# EAGLE design projekt (EAGLE 7.5.0)
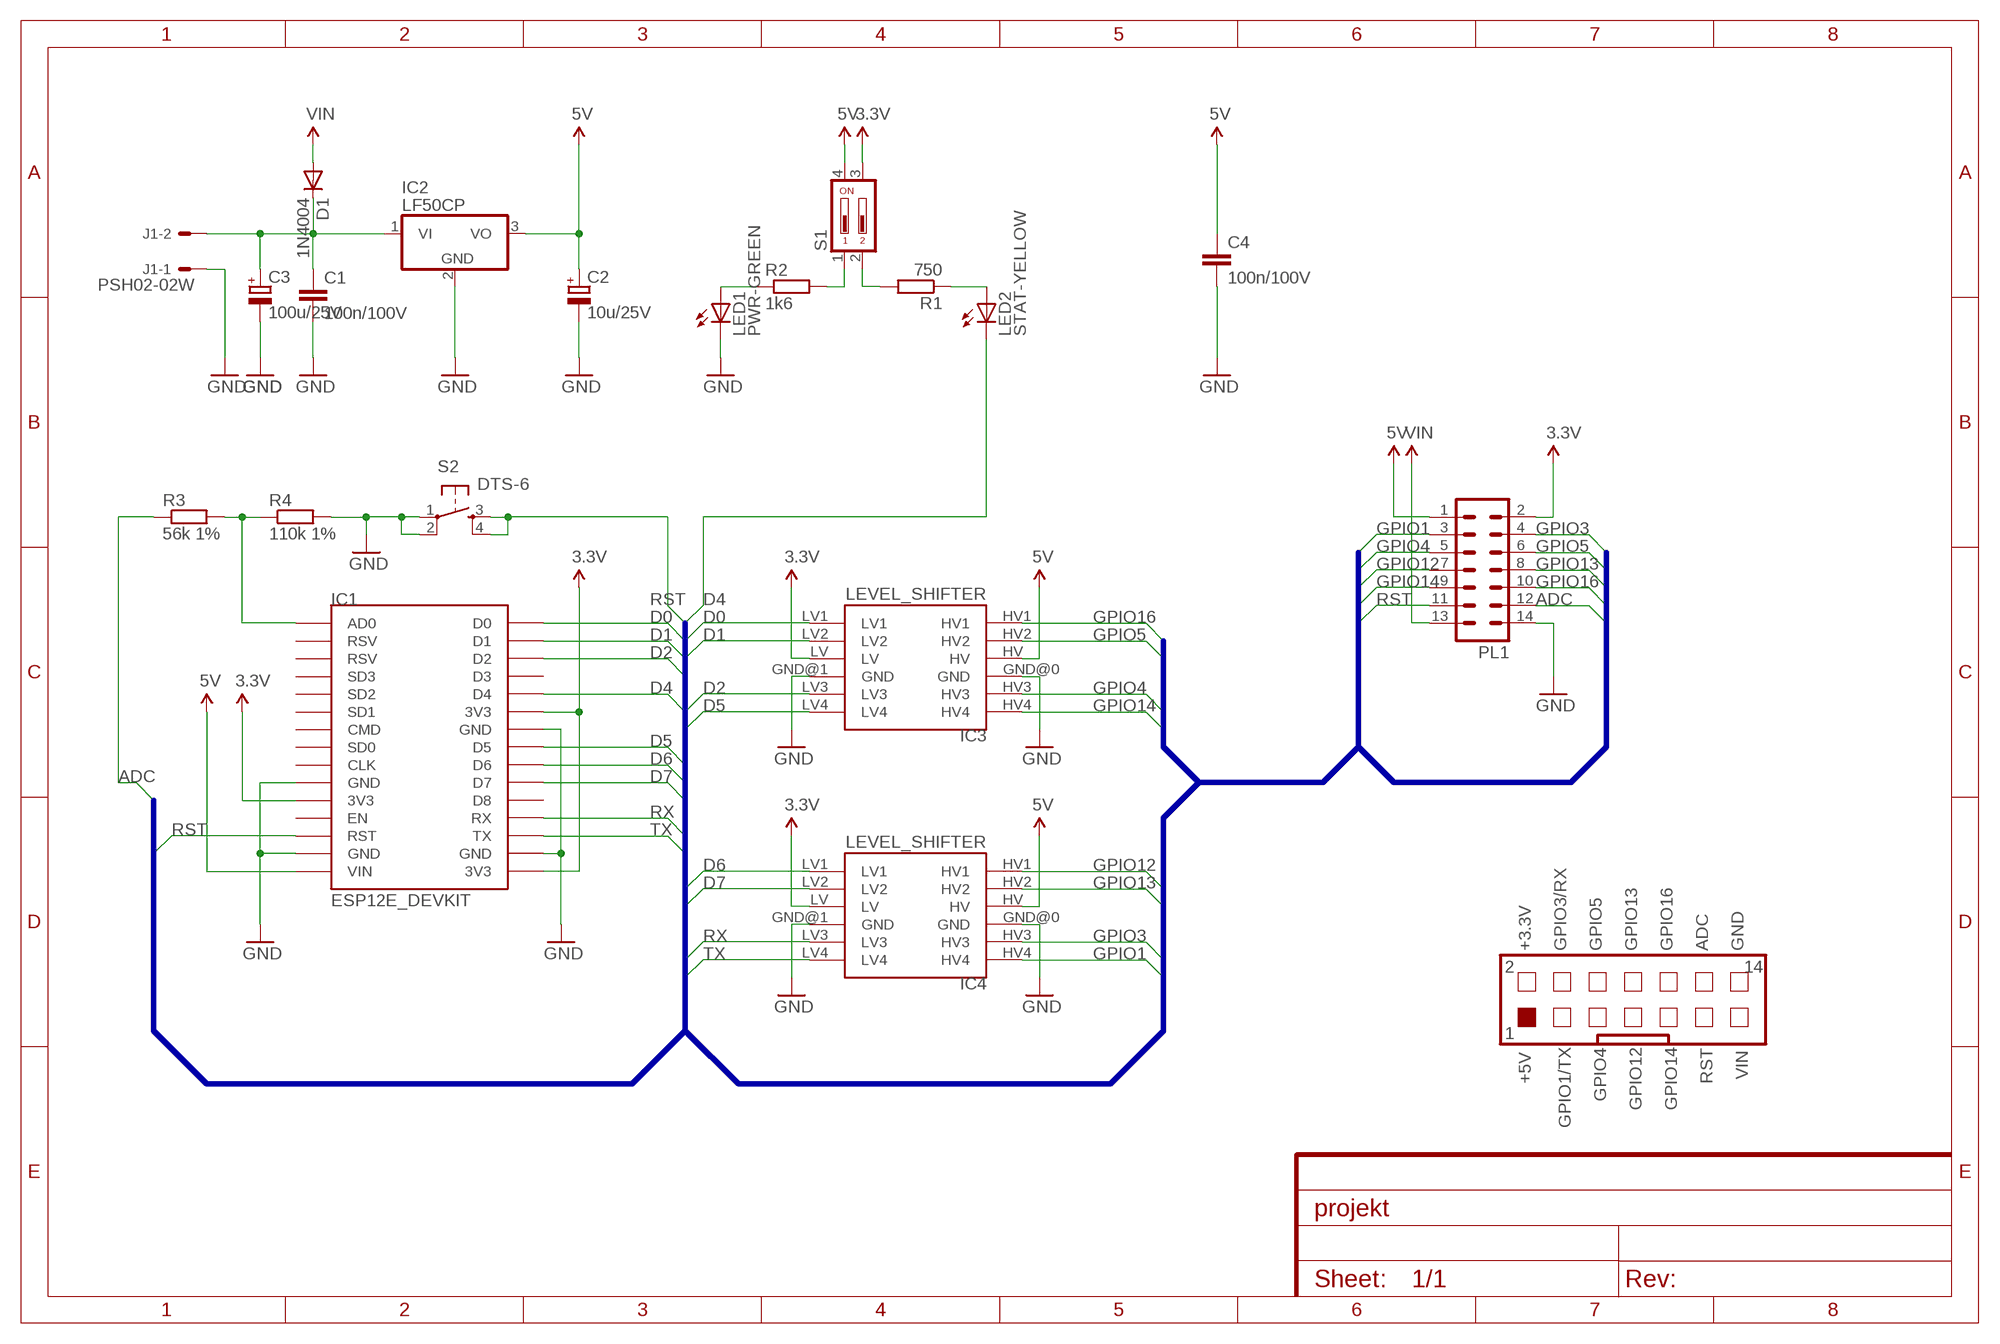
[diagram p0: schematic, sheet 1]
FRAME1 (FRAME-A4L): CNAME: IoT Lab Module; CREVISION: 2; DESIGNER: Vagovszky M.

## Parts
C1  100n/100V  C-EUC025-025X050  [C025-025X050]
C2  10u/25V  CPOL-EUE3,5-8  [E3,5-8]
C3  100u/25V  CPOL-EUE5-13  [E5-13]
C4  100n/100V  C-EUC025-025X050  [C025-025X050]
D1  1N4004  [DO41-10]
IC1  ESP12E_DEVKIT  [ESP12E_DEVKIT]
IC2  LF50CP  [TO220H]
IC3  LEVEL_SHIFTER  [LEVEL_SHIFTER]
IC4  LEVEL_SHIFTER  [LEVEL_SHIFTER]
J1  PSH02-02W  22-05-7028-02  [7395-02]
LED1  PWR-GREEN  LED3MM  [LED3MM]
LED2  STAT-YELLOW  LED3MM  [LED3MM]
PL1  14H  [14H]
R1  750  R-EU_R1206  [R1206]
R2  1k6  R-EU_R1206  [R1206]
R3  56k 1%  R-EU_R1206  [R1206]
R4  110k 1%  R-EU_R1206  [R1206]
S1  DIP02YL  [DIP02YL]
S2  DTS-6  [DTS-6]

## Nets
3.3V: IC1.3V3@0(3V3) IC1.3V3@1(3V3) IC1.3V3@2(3V3) IC3.LV IC4.LV PL1.2 S1.3
5V: C2.+ C4.1 IC1.VIN IC2.3(VO) IC3.HV IC4.HV PL1.1 S1.4
ADC: PL1.12 R3.1
D0: IC1.D0 IC3.LV1
D1: IC1.D1 IC3.LV2
D2: IC1.D2 IC3.LV3
D4: IC1.D4 LED2.K(C)
D5: IC1.D5 IC3.LV4
D6: IC1.D6 IC4.LV1
D7: IC1.D7 IC4.LV2
GND: C1.2 C2.- C3.- C4.2 IC1.GND@0(GND) IC1.GND@1(GND) IC1.GND@2(GND) IC1.GND@3(GND) IC2.2(GND) IC3.GND@0(GND) IC3.GND@1(GND) IC4.GND@0(GND) IC4.GND@1(GND) J1.1 LED1.K(C) PL1.14 R4.2 S2.1 S2.2
GPIO1: IC4.HV4 PL1.3
GPIO3: IC4.HV3 PL1.4
GPIO4: IC3.HV3 PL1.5
GPIO5: IC3.HV2 PL1.6
GPIO12: IC4.HV1 PL1.7
GPIO13: IC4.HV2 PL1.8
GPIO14: IC3.HV4 PL1.9
GPIO16: IC3.HV1 PL1.10
N$1: IC1.AD0 R3.2 R4.1
N$2: LED1.A R2.1
N$3: R2.2 S1.1
N$5: R1.2 S1.2
N$6: LED2.A R1.1
N$14: C1.1 C3.+ D1.C IC2.1(VI) J1.2
RST: IC1.RST PL1.11 S2.3 S2.4
RX: IC1.RX IC4.LV3
TX: IC1.TX IC4.LV4
VIN: D1.A PL1.13
Unconnected: IC1.CLK IC1.CMD IC1.D3 IC1.D8 IC1.EN IC1.RSV@0(RSV) IC1.RSV@1(RSV) IC1.SD0 IC1.SD1 IC1.SD2 IC1.SD3

## Buses
BUS:RST,ADC,D[0..2],D[4..7],RX,TX,GPIO16,GPIO[4..5],GPIO[12..14],GPIO1,GPIO3

## Notes on the sheet
- +3.3V | GPIO3/RX | GPIO5 | GPIO13 | GPIO16 | ADC | GND
- 2 | 14
- 1
- +5V | RST | VIN
- GPIO4
- GPIO12 | GPIO14
- GPIO1/TX

## Library data of the parts
C1 C4 = parts:C-EU: C-EU
C2 C3 = parts:CPOL-EU: C-POL EU
D1 = adafruit:1N4004: DIODE General purpose 1N400x type rectifier (With bigger pads) http://www.ladyada.net/library/pcb/eaglelibrary.html
IC1 = ESP12E_DEVKIT:ESP12E_DEVKIT: ESP12E DEVKIT BOARD
IC2 = parts:LF50: 5V LDO Regulator
IC3 IC4 = level_shifter:LEVEL_SHIFTER: Level shifter 5V <=> 3.3V
J1 = con-molex:22-?-02: CONNECTOR wire to board 2.54 mm (.1 inch) pitch header; OC_FARNELL: 9731601; OC_NEWARK: unknown
LED1 LED2 = adafruit:LED: LED OSRAM: - CHIPLED LG R971, LG N971, LY N971, LG Q971, LY Q971, LO R971, LY R971 LH N974, LH R974 LS Q976, LO Q976, LY Q976 LO Q996 - Hyper CHIPLED LW Q18S LB Q993, LB Q99A, LB R99A - SideLED LS A670, LO A670, LY A670, LG A670, LP A670 LB A673, LV A673, LT A673, LW A673 LH A674 LY A675 LS A676, LA A676, LO A676, LY A676, LW A676 LS A679, LY A679, LG A679 - Hyper Micro SIDELED® LS Y876, LA Y876, LO Y876, LY Y876 LT Y87S - SmartLED LW L88C, LW L88S LB L89C, LB L89S, LG L890 LS L89K, LO L89K, LY L89K LS L896, LA L896, LO L896, LY L896 - TOPLED LS T670, LO T670, LY T670, LG T670, LP T670 LSG T670, LSP T670, LSY T670, LOP T670, LYG T670 LG T671, LOG T671, LSG T671 LB T673, LV T673, LT T673, LW T673 LH T674 LS T676, LA T676, LO T676, LY T676, LB T676, LH T676, LSB T676, LW T676 LB T67C, LV T67C, LT T67C, LS T67K, LO T67K, LY T67K, LW E67C LS E67B, LA E67B, LO E67B, LY E67B, LB E67C, LV E67C, LT E67C LW T67C LS T679, LY T679, LG T679 LS T770, LO T770, LY T770, LG T770, LP T770 LB T773, LV T773, LT T773, LW T773 LH T774 LS E675, LA E675, LY E675, LS T675 LS T776, LA T776, LO T776, LY T776, LB T776 LHGB T686 LT T68C, LB T68C - Hyper Mini TOPLED® LB M676 - Mini TOPLED Santana® LG M470 LS M47K, LO M47K, LY M47K Source: http://www.osram.convergy.de/
PL1 = parts:14H: CONNECTOR; OC_FARNELL: unknown; OC_NEWARK: unknown
R1-R4 = rcl:R-EU_: RESISTOR, European symbol
S1 = switch-dil:DIP02YL: DIL/CODE SWITCH; OC_FARNELL: unknown; OC_NEWARK: unknown
S2 = switch-tact:DTS-6

## Board
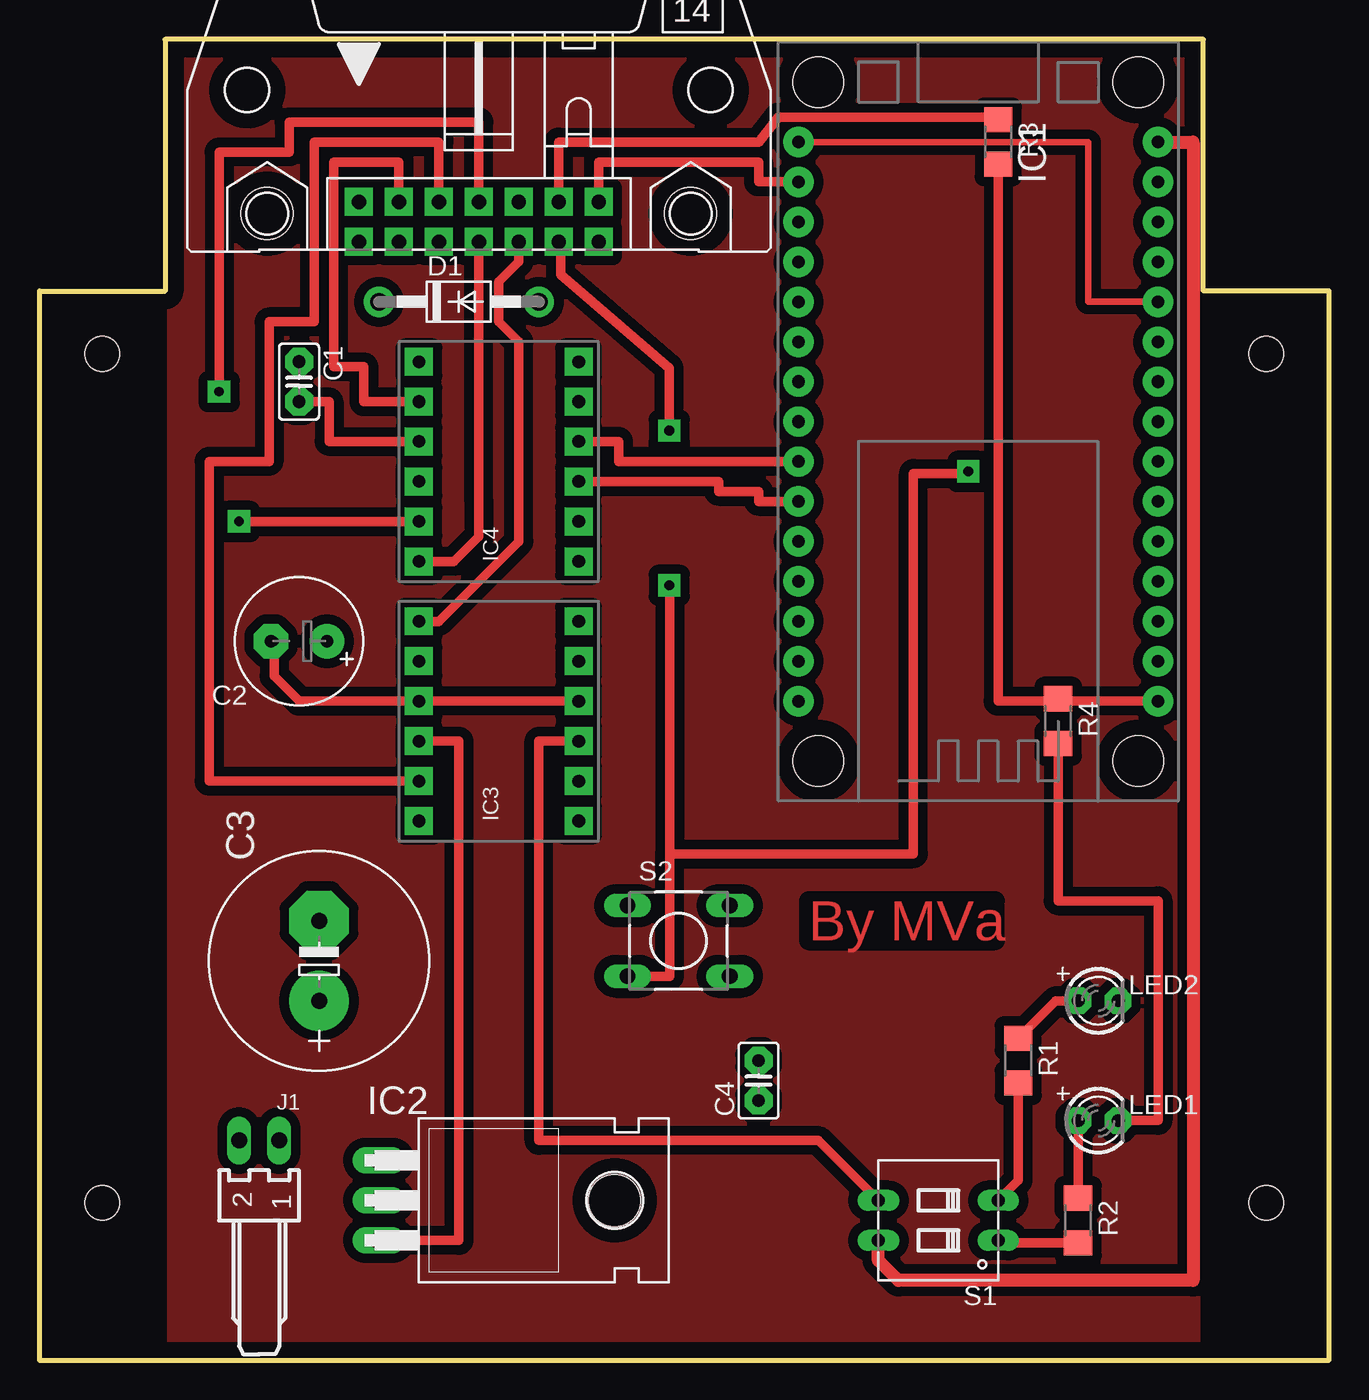
[diagram p1: board, top side]
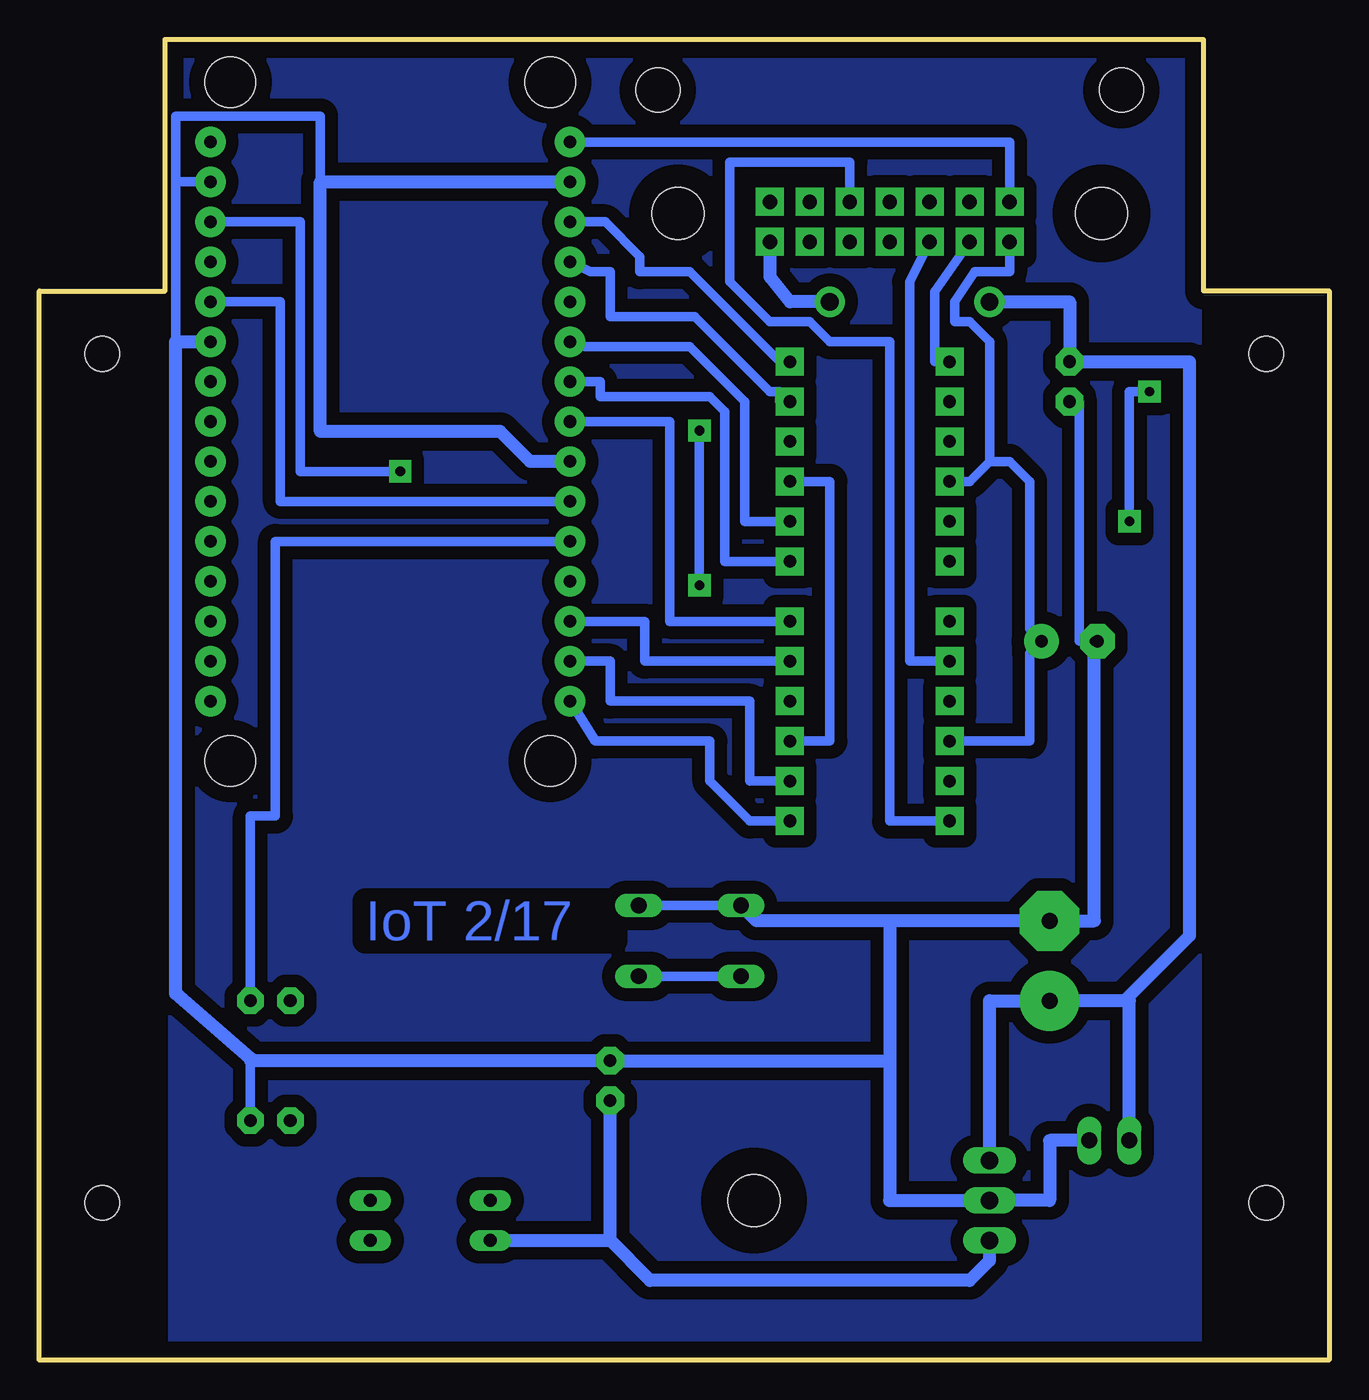
[diagram p2: board, bottom side, seen from below]

Size 82 x 84 mm. Coordinates in mm from the lower left corner, seen from the top.
Outline: 0,0 82,0 82,68 74,68 74,84 8,84 8,68 0,68 0,0
Copper layers (1*16): Top 0.035mm / dielectric 1.5mm / Bottom 0.035mm
Design rules "default": minimum track width 10mil, minimum drill 24mil, track to track 8mil, track to pad 8mil, pad to pad 8mil, via to via 8mil, smd to smd 8mil, copper to edge 40mil, drill to drill 8mil, minimum pad ring 10mil, minimum via ring 8mil, stop-mask expansion 4mil, vias tented up to drill 0mil, thermal gap 10mil
Holes 2.2 mm at 4,10 78,10 78,64 4,64
Holes 2.8 mm at 13.21,80.77 42.67,80.77

### Footprints (pad centres in the part's own frame; a part is rotated, then mirrored left to right if it is on the bottom)
C025-025X050 = drill 0.813 pad 1.778 octagon: 1 -1.27,0; 2 1.27,0
E3,5-8 = drill 0.813 pad 2.184: + -1.778,0 | drill 0.813 pad 2.184 octagon: - 1.778,0
E5-13 = drill 1.016 pad 3.81: + -2.54,0 | drill 1.016 pad 3.81 octagon: - 2.54,0
DO41-10 = drill 1.118 pad 1.93: A 5.08,0; C -5.08,0
ESP12E_DEVKIT = drill 0.8 pad 1.93: 3V3@0 -11.43,-7.62; 3V3@1 11.43,5.08; 3V3@2 11.43,-17.78; AD0 -11.43,17.78; CLK -11.43,-2.54; CMD -11.43,2.54; D0 11.43,17.78; D1 11.43,15.24; D2 11.43,12.7; D3 11.43,10.16; D4 11.43,7.62; D5 11.43,0; D6 11.43,-2.54; D7 11.43,-5.08; D8 11.43,-7.62; EN -11.43,-10.16; GND@0 -11.43,-5.08; GND@1 -11.43,-15.24; GND@2 11.43,2.54; GND@3 11.43,-15.24; RST -11.43,-12.7; RSV@0 -11.43,15.24; RSV@1 -11.43,12.7; RX 11.43,-10.16; SD0 -11.43,0; SD1 -11.43,5.08; SD2 -11.43,7.62; SD3 -11.43,10.16; TX 11.43,-12.7; VIN -11.43,-17.78 | hole 3.2: -10.16,21.59; 10.16,21.59; 10.16,-21.59; -10.16,-21.59
TO220H = drill 1.118 long: 1 -2.54,-10.16; 2 0,-10.16; 3 2.54,-10.16 | hole 3.302: 0,4.826
LEVEL_SHIFTER = drill 0.8 pad 1.778 square: GND@0 -5.08,1.27; GND@1 5.08,1.27; HV -5.08,-1.27; HV1 -5.08,-6.35; HV2 -5.08,-3.81; HV3 -5.08,3.81; HV4 -5.08,6.35; LV 5.08,-1.27; LV1 5.08,-6.35; LV2 5.08,-3.81; LV3 5.08,3.81; LV4 5.08,6.35
7395-02 = drill 1.016 long: 1 1.27,0; 2 -1.27,0
LED3MM = drill 0.813 pad 1.676 octagon: A -1.27,0; K 1.27,0
14H = drill 0.914 pad 1.778 square: 1 -7.62,-1.27; 2 -7.62,1.27; 3 -5.08,-1.27; 4 -5.08,1.27; 5 -2.54,-1.27; 6 -2.54,1.27; 7 0,-1.27; 8 0,1.27; 9 2.54,-1.27; 10 2.54,1.27; 11 5.08,-1.27; 12 5.08,1.27; 13 7.62,-1.27; 14 7.62,1.27 | hole 3.302: -13.462,0.533; 13.462,0.533
R1206 = smd 1.6 x 1.803: 1 -1.422,0; 2 1.422,0
DIP02YL = drill 0.813 long: 1 -1.27,-3.81; 2 1.27,-3.81; 3 1.27,3.81; 4 -1.27,3.81
DTS-6 = drill 1 long: 1 -3.25,2.25; 2 3.25,2.25; 3 -3.25,-2.25; 4 3.25,-2.25

### Placement (x,y rotation side)
C1  16.51,62.23 270 top
C2  16.51,45.72 180 top
C3  17.78,25.4 90 top
C4  45.72,17.78 90 top
D1  26.67,67.31 0 top
IC1  59.69,59.69 180 top
IC2  31.75,10.16 270 top
IC3  29.21,40.64 0 top
IC4  29.21,57.15 0 top
J1  13.97,13.97 0 top
LED1  67.31,15.24 0 top
LED2  67.31,22.86 0 top
PL1  27.94,72.39 0 top
R1  62.23,19.05 270 top
R2  66.04,8.89 270 top
R3  60.96,77.47 270 top
R4  64.77,40.64 270 top
S1  57.15,8.89 90 top
S2  40.64,26.67 0 top

### Tracks (layer width: path | path; a pad name or v marks a point on that pad's centre or on a via)
3.3V
  Top 0.406: IC1.3V3@0 66.67,67.31 66.67,77.47 IC1.3V3@2
  Top 0.61: S1.3 49.53,13.97 31.75,13.97 31.75,39.37 IC3.LV | IC4.LV 43.18,55.88 43.18,55.24 45.72,55.24 45.72,54.61 IC1.3V3@1
  Bottom 0.61: PL1.2 20.32,77.47 IC1.3V3@2 | IC3.LV 31.75,39.37 31.75,55.88 IC4.LV | IC1.3V3@1 66.67,54.61 66.67,67.31 IC1.3V3@0
5V
  Top 0.61: IC3.HV 26.67,39.37 26.67,7.62 IC2.3
  Top 0.813: IC1.VIN 73.34,77.47 73.34,5.08 54.61,5.08 53.34,6.35 S1.4
  Bottom 0.61: 21.59,57.15 21.59,64.77 22.86,66.04 23.81,66.04 23.81,67.31 22.54,69.22 20.32,69.22 PL1.1 | 21.59,57.15 22.86,55.88 IC4.HV | 21.59,57.15 20.32,57.15 19.05,55.88 19.05,46.48 C2.+ 19.05,44.96 19.05,39.37 IC3.HV
  Bottom 0.813: IC2.3 21.59,6.35 22.86,5.08 43.18,5.08 45.72,7.62 | S1.4 45.72,7.62 | 45.72,7.62 C4.1
ADC
  Top 0.406: 60.96,79.38 R3.1 60.96,79.06
  Top 0.61: PL1.12 33.02,77.47 45.72,77.47 46.99,79.06 | 46.99,78.99 46.99,79.06 | 46.99,79.06 60.96,79.06
D0
  Bottom 0.61: IC3.LV1 36.83,34.29 39.37,36.83 39.37,39.37 46.67,39.37 IC1.D0
D1
  Bottom 0.61: IC3.LV2 36.83,36.83 36.83,41.91 45.72,41.91 45.72,44.45 IC1.D1
D2
  Bottom 0.61: IC3.LV3 43.5,44.45 43.5,46.99 IC1.D2
D4
  Bottom 0.61: IC1.D4 66.99,52.07 66.99,34.61 68.58,34.61 LED2.K
D5
  Bottom 0.61: IC1.D5 41.91,59.69 41.91,46.99 IC3.LV4
D6
  Bottom 0.61: IC4.LV1 38.42,50.8 38.42,60.33 39.37,61.28 46.35,61.28 46.35,62.23 IC1.D6
D7
  Bottom 0.61: IC4.LV2 37.15,53.34 37.15,60.96 40.64,64.45 47.31,64.45 IC1.D7
GND  (via drill 0.6)
  Top 0.61: IC3.GND@1 IC3.GND@0 16.51,41.91 14.92,43.5 v14.92,45.72 | R4.2 64.77,29.21 71.12,29.21 71.12,15.24 LED1.K | PL1.14 35.56,76.2 45.72,76.2 45.72,74.93 IC1.GND@3 | C1.2 18.41,60.96 18.41,58.42 IC4.GND@0 | IC1.GND@2 36.83,57.15 36.83,58.42 IC4.GND@1
  Bottom 0.254: v14.92,45.72 C2.- | 68.58,19.2 68.58,19.05
  Bottom 0.406: C1.2 15.88,60.96
  Bottom 0.61: 73.33,64.77 73.34,64.77 73.34,74.93 | 64.14,74.93 64.14,79.12 73.34,79.12 73.34,74.93 | 68.58,19.05 LED1.K | S2.1 S2.2 | 15.88,60.96 15.88,45.72 v14.92,45.72 | IC1.GND@1 73.34,74.93
  Bottom 0.813: 27.94,27.94 36.41,27.94 S2.1 | IC1.GND@0 73.33,64.77 73.33,23.32 68.58,19.2 | IC1.GND@3 64.14,74.93 64.14,59.05 52.7,59.05 50.8,57.15 IC1.GND@2 | J1.1 17.78,13.97 17.78,10.16 IC2.2 27.94,10.16 27.94,19.05 | 27.94,27.94 C3.- 14.92,27.94 v14.92,45.72 | 27.94,27.94 27.94,19.05 | 27.94,19.05 C4.2 68.58,19.05
GPIO1
  Bottom 0.61: IC4.HV4 25.08,63.5 25.08,67.94 PL1.3
GPIO3
  Top 0.61: PL1.4 22.86,76.2 18.73,76.2 18.73,63.18 20.64,63.18 20.64,60.96 IC4.HV3
GPIO4
  Bottom 0.61: PL1.5 26.67,68.58 26.67,44.45 IC3.HV3
GPIO5
  Top 0.61: PL1.6 25.4,77.47 17.46,77.47 17.46,66.04 14.61,66.04 14.61,57.15 10.79,57.15 10.79,36.83 IC3.HV2
GPIO12
  Top 0.61: PL1.7 27.94,54.61 27.94,52.39 26.35,50.8 IC4.HV1
GPIO13  (via drill 0.6 pad 1.42)
  Top 0.61: PL1.8 27.94,78.74 15.88,78.74 15.88,76.83 11.43,76.83 v11.43,61.59 | v12.7,53.34 IC4.HV2
  Bottom 0.61: v11.43,61.59 12.7,61.59 v12.7,53.34
GPIO14
  Top 0.61: IC3.HV4 25.4,46.99 30.48,52.07 30.48,64.77 29.21,66.04 29.21,68.58 30.48,69.85 PL1.9
GPIO16
  Bottom 0.61: PL1.10 30.48,76.2 38.1,76.2 38.1,68.58 35.56,66.04 33.02,66.04 31.75,64.77 27.94,64.77 27.94,34.29 IC3.HV1
N$1
  Top 0.406: 64.92,41.91 R4.1 64.62,41.91
  Top 0.61: IC1.AD0 64.92,41.91 60.96,41.91 R3.2
N$2
  Top 0.61: R2.1 LED1.A
N$3
  Top 0.406: S1.1 61.11,7.47
  Top 0.61: 61.11,7.47 R2.2
N$5
  Top 0.61: S1.2 62.23,11.43 R1.2
N$6
  Top 0.61: R1.1 64.62,22.86 LED2.A
N$7
  pour Bottom (isolate 0.813): 8.26,83.82 8.26,0.32 73.66,0.32 73.66,83.82
N$8
  pour Top (isolate 0.61): 8.26,83.82 8.26,0.32 73.66,0.32 73.66,83.82
N$14
  Bottom 0.406: 12.7,22.86 13.02,22.86
  Bottom 0.813: D1.C 16.51,67.31 C1.1 8.89,63.5 8.89,30.48 8.89,26.99 13.02,22.86 C3.+ 21.59,22.86 IC2.1 | J1.2 12.7,22.86
RST  (via drill 0.61 pad 1.42)
  Top 0.254: 33.15,71.09 PL1.11
  Top 0.61: 33.15,71.09 33.15,69.04 40.04,63.09 v40.04,59.12 | v40.04,49.28 40.07,49.28 40.07,32.19 | 40.07,32.19 55.56,32.19 55.56,56.39 59.05,56.39 v59.05,56.52 | S2.3 40.07,24.42 40.07,32.19
  Bottom 0.61: v40.04,49.28 v40.04,59.12 | IC1.RST 65.41,72.39 65.41,56.52 v59.05,56.52 | S2.3 S2.4
RX
  Bottom 0.61: IC4.LV3 34.92,60.96 34.92,61.59 35.56,61.59 40.32,66.36 45.72,66.36 45.72,69.22 46.99,69.22 IC1.RX
TX
  Bottom 0.406: IC4.LV4 34.92,63.5
  Bottom 0.61: IC1.TX 46.04,72.39 43.81,70.17 43.81,69.22 40.64,69.22 34.92,63.5
VIN
  Bottom 0.813: D1.A 34.29,67.31 35.56,68.9 PL1.13

### Text on the board
Top: By MVa
Bottom: IoT 2/17